# EAGLE board DL0WH_BiTuner_Ctrl_1V2 (EAGLE 7.7.0)
DL0WH Antenna BiTuner
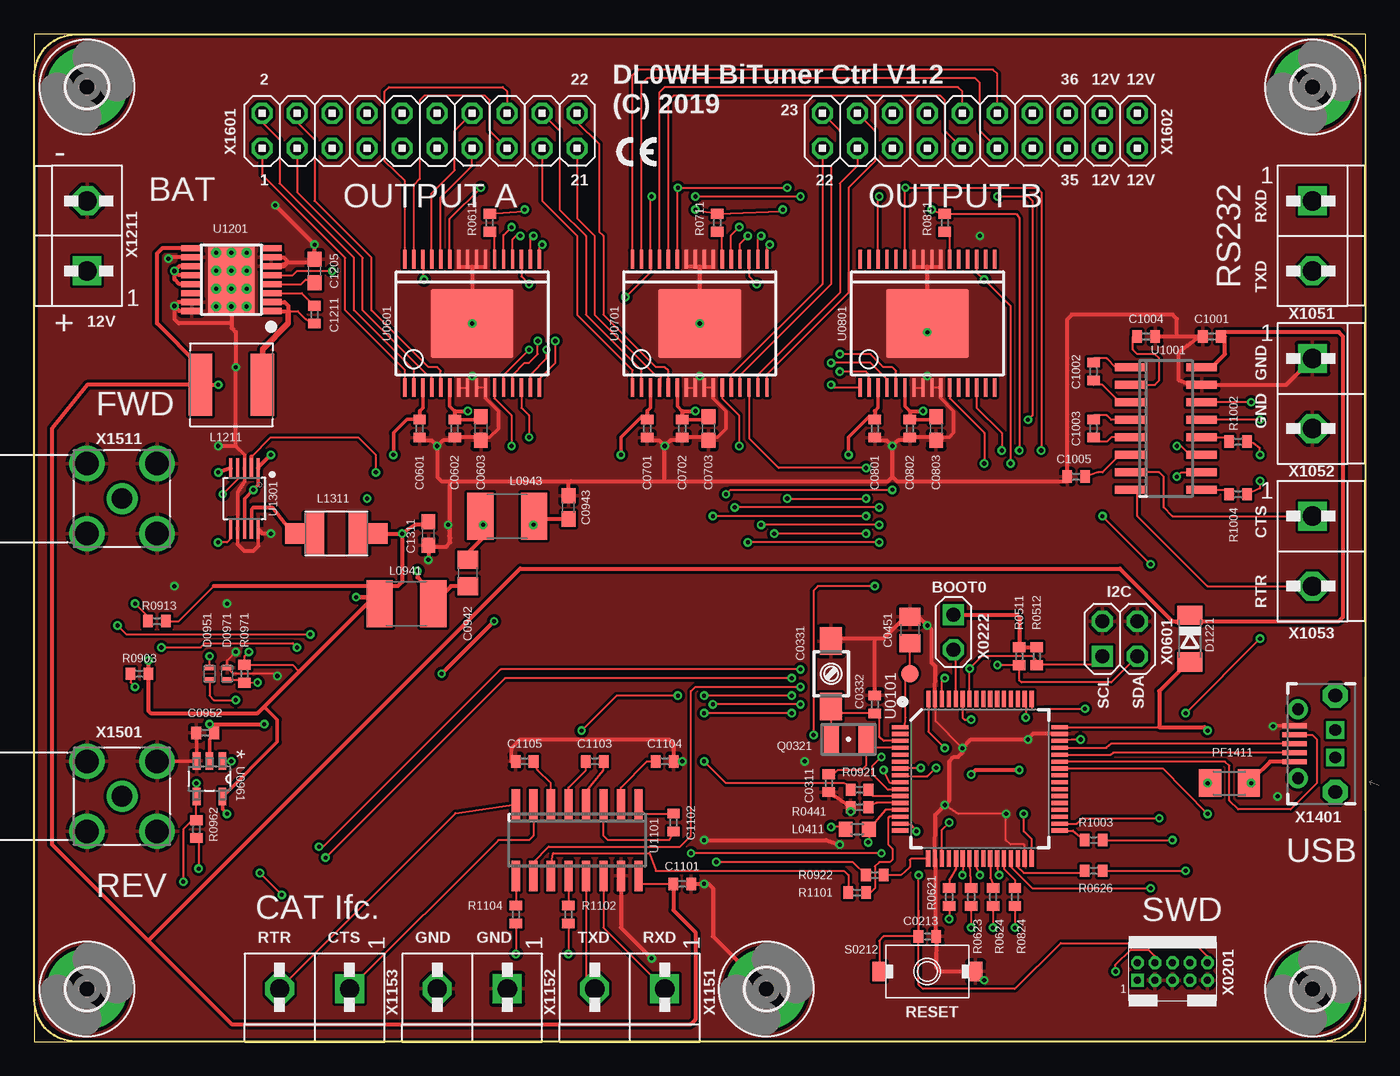
[diagram p17: board, top side]
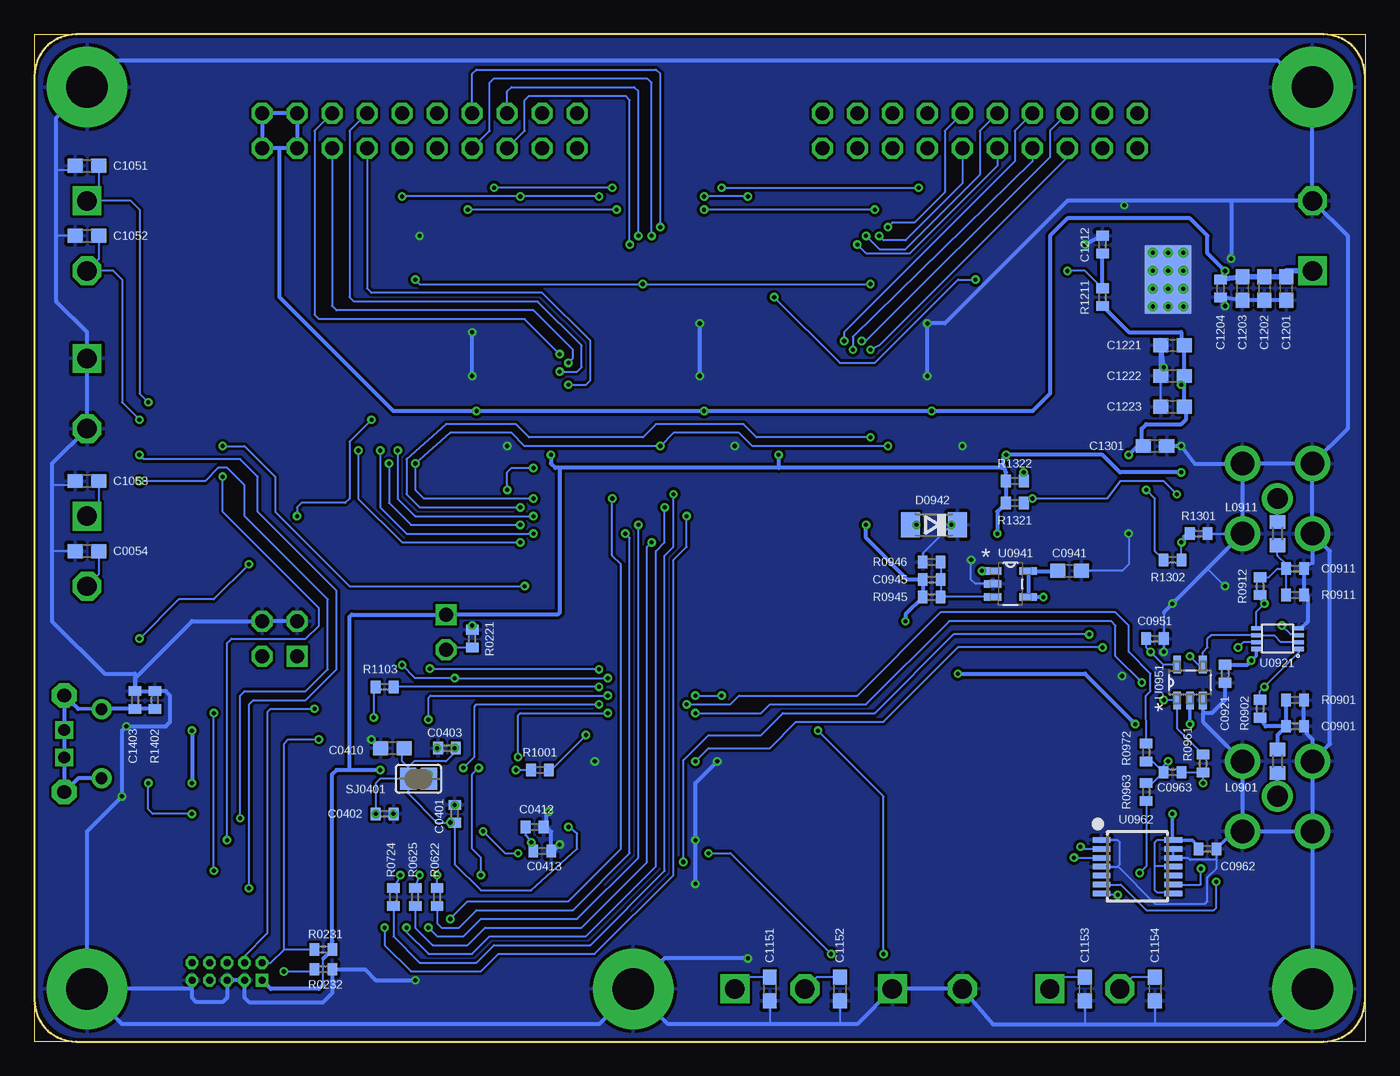
[diagram p18: board, bottom side, seen from below]

Size 96.52 x 73.03 mm. Coordinates in mm from the lower left corner, seen from the top.
Outline: 0,0 96.52,0 96.52,73.03 0,73.03 0,0
Copper layers (1*16): Top 0.035mm / dielectric 1.5mm / Bottom 0.035mm
Design rules "DL0WH_BiTuner_MCU_1V2": minimum track width 6mil, minimum drill 0.3mm, track to track 8mil, track to pad 8mil, pad to pad 6mil, via to via 8mil, smd to smd 0mil, copper to edge 10mil, drill to drill 10mil, minimum pad ring 8mil, minimum via ring 6mil, stop-mask expansion 2mil, vias tented up to drill 25mil, thermal gap 10mil
Net classes: 1 pwr_relay: width 1.5 mm, clearance 0.5 mm; 2 pwr_ttl: width 0.75 mm, clearance 0.5 mm; 3 usb_pair: width 0.254 mm, clearance 0.152 mm; 4 pwrA5: width 0.4 mm; 5 single50R: width 0.838 mm, clearance 0.152 mm; 6 mil6_nofill: width 0.152 mm, clearance 0.254 mm
Milling: 8 lines

## Footprints (pad centres in the part's own frame; a part is rotated, then mirrored left to right if it is on the bottom)
C0603 = smd 1.1 x 1: 1 -0.85,0; 2 0.85,0
C0402 = smd 0.7 x 0.9: 1 -0.65,0; 2 0.65,0
3MM2_X_2MM5 = smd 2 x 1.6: + -2.365,0; - 2.365,0
C0805 = smd 1.3 x 1.5: 1 -0.95,0; 2 0.95,0
SOD80C = smd 1.4 x 1.8: A 1.7,0; C -1.7,0
SOD923 = smd 0.4 x 0.6: A 0.45,0; C -0.45,0
3,0-PAD = drill 3 pad 5.842: B3,0 0,0
L0603 = smd 1 x 1.1: 1 -0.85,0; 2 0.85,0
L1812 = smd 1.9 x 3.4: 1 -1.95,0; 2 1.95,0
L_6.00MM_X_6.00MM = smd 1.7 x 4.5: 1 -2.25,0; 2 2.25,0
L_4.50MM_X_3.20MM = smd 1.5 x 3: 1 -1.6,0; 2 1.6,0 | smd 2 x 1.5: 3 -2.75,0; 4 2.75,0
M1206 = smd 1.6 x 2: 1 -1.4,0; 2 1.4,0
ABS07 = smd 1.1 x 1.9: 1 -1.25,0; 2 1.25,0
R0402 = smd 0.7 x 0.9: 1 -0.65,0; 2 0.65,0
KSR223G_SMD_1POL = smd 1 x 1.4: 1 -3.5,0; 2 3.5,0
SJ = smd 1.168 x 1.6: 1 -0.762,0; 2 0.762,0
B1,27 = smd 1.27 x 1.27: TP 0,0
LQFP64 = smd 1.2 x 0.3: 1 -5.775,3.75; 2 -5.775,3.25; 3 -5.775,2.75; 4 -5.775,2.25; 5 -5.775,1.75; 6 -5.775,1.25; 7 -5.775,0.75; 8 -5.775,0.25; 9 -5.775,-0.25; 10 -5.775,-0.75; 11 -5.775,-1.25; 12 -5.775,-1.75; 13 -5.775,-2.25; 14 -5.775,-2.75; 15 -5.775,-3.25; 16 -5.775,-3.75; 33 5.775,-3.75; 34 5.775,-3.25; 35 5.775,-2.75; 36 5.775,-2.25; 37 5.775,-1.75; 38 5.775,-1.25; 39 5.775,-0.75; 40 5.775,-0.25; 41 5.775,0.25; 42 5.775,0.75; 43 5.775,1.25; 44 5.775,1.75; 45 5.775,2.25; 46 5.775,2.75; 47 5.775,3.25; 48 5.775,3.75 | smd 0.3 x 1.2: 17 -3.75,-5.775; 18 -3.25,-5.775; 19 -2.75,-5.775; 20 -2.25,-5.775; 21 -1.725,-5.775; 22 -1.25,-5.775; 23 -0.75,-5.775; 24 -0.25,-5.775; 25 0.25,-5.775; 26 0.75,-5.775; 27 1.25,-5.775; 28 1.75,-5.775; 29 2.25,-5.775; 30 2.75,-5.775; 31 3.25,-5.775; 32 3.75,-5.775; 49 3.75,5.775; 50 3.25,5.775; 51 2.75,5.775; 52 2.25,5.775; 53 1.75,5.775; 54 1.25,5.775; 55 0.75,5.775; 56 0.25,5.775; 57 -0.25,5.775; 58 -0.75,5.775; 59 -1.25,5.775; 60 -1.75,5.775; 61 -2.25,5.775; 62 -2.75,5.775; 63 -3.25,5.775; 64 -3.725,5.775
SOICW32 = smd 0.25 x 1.3: 1 -4.875,-4.65; 2 -4.225,-4.65; 3 -3.575,-4.65; 4 -2.925,-4.65; 5 -2.275,-4.65; 6 -1.625,-4.65; 7 -0.975,-4.65; 8 -0.325,-4.65; 9 0.325,-4.65; 10 0.975,-4.65; 11 1.625,-4.65; 12 2.275,-4.65; 13 2.925,-4.65; 14 3.575,-4.65; 15 4.225,-4.65; 16 4.875,-4.65; 17 4.875,4.65; 18 4.225,4.65; 19 3.575,4.65; 20 2.925,4.65; 21 2.275,4.65; 22 1.625,4.65; 23 0.975,4.65; 24 0.325,4.65; 25 -0.325,4.65; 26 -0.975,4.65; 27 -1.625,4.65; 28 -2.275,4.65; 29 -2.925,4.65; 30 -3.575,4.65; 31 -4.225,4.65; 32 -4.875,4.65 | smd 6 x 5: 33 0,0
R-PDSO-G8 = smd 0.25 x 0.75: 1 -0.75,-1.55; 2 -0.25,-1.55; 3 0.25,-1.55; 4 0.75,-1.55; 5 0.75,1.55; 6 0.25,1.55; 7 -0.25,1.55; 8 -0.75,1.55
SOT95P280X145-5N = smd 1.27 x 0.559: 1 -1.295,0.94; 2 -1.295,0; 3 -1.295,-0.94; 4 1.295,-0.94; 5 1.295,0.94
SOT-23-5 = smd 1.27 x 0.559: 1 -1.295,0.94; 2 -1.295,0; 3 -1.295,-0.94; 4 1.295,-0.94; 5 1.295,0.94
TSSOP14 = smd 0.4 x 1.3: 1 -1.925,-2.6; 2 -1.275,-2.6; 3 -0.625,-2.6; 4 0.025,-2.6; 5 0.675,-2.6; 6 1.325,-2.6; 7 1.975,-2.6; 8 1.975,2.6; 9 1.325,2.6; 10 0.675,2.6; 11 0.025,2.6; 12 -0.625,2.6; 13 -1.275,2.6; 14 -1.925,2.6
SOIC16N = smd 0.6 x 2.2: 1 -4.445,-2.6; 2 -3.175,-2.6; 3 -1.905,-2.6; 4 -0.635,-2.6; 5 0.635,-2.6; 6 1.905,-2.6; 7 3.175,-2.6; 8 4.445,-2.6; 9 4.445,2.6; 10 3.175,2.6; 11 1.905,2.6; 12 0.635,2.6; 13 -0.635,2.6; 14 -1.905,2.6; 15 -3.175,2.6; 16 -4.445,2.6
HTSSOP16 = smd 0.45 x 1.5: 1 -2.275,-2.9; 2 -1.625,-2.9; 3 -0.975,-2.9; 4 -0.325,-2.9; 5 0.325,-2.9; 6 0.975,-2.9; 7 1.625,-2.9; 8 2.275,-2.9; 9 2.275,2.9; 10 1.625,2.9; 11 0.975,2.9; 12 0.325,2.9; 13 -0.325,2.9; 14 -0.975,2.9; 15 -1.625,2.9; 16 -2.275,2.9 | drill 0.305 pad 0.61: PAD 0.65,0; PAD3 -0.65,0; PAD4 -1.95,0; PAD5 1.95,0; PAD6 1.95,1.1; PAD7 1.95,-1.1; PAD8 0.65,1.1; PAD9 0.65,-1.1; PAD10 -0.65,1.1; PAD11 -0.65,-1.1; PAD12 -1.95,1.1; PAD13 -1.95,-1.1 | smd 5 x 3.4: PAD1 0,0 | smd 5 x 3.4 bottom: PAD2 0,0
S-PDSO-G10 = smd 0.3 x 1.45: 1 -1,-2.2; 2 -0.5,-2.2; 3 0,-2.2; 4 0.5,-2.2; 5 1,-2.2; 6 1,2.2; 7 0.5,2.2; 8 0,2.2; 9 -0.5,2.2; 10 -1,2.2
2X05_1MM27_SHROUDED_CORTEX_JTAG_SWD = drill 0.5 pad 0.914 square: 1 -2.54,-0.635 | drill 0.5 pad 0.914 octagon: 2 -2.54,0.635; 3 -1.27,-0.635; 4 -1.27,0.635; 5 0,-0.635; 6 0,0.635; 7 1.27,-0.635; 8 1.27,0.635; 9 2.54,-0.635; 10 2.54,0.635
1X02 = drill 1.016 square: 1 0,0 | drill 1.016 octagon: 2 0,2.54
2X02 = drill 1.016 square: 1 -1.27,-1.27 | drill 1.016 octagon: 2 -1.27,1.27; 3 1.27,-1.27; 4 1.27,1.27
WIRE-TO-BOARD_5MM08_1X02 = drill 1.4 square: 1 0,2.54 | drill 1.4 octagon: 2 0,-2.54
USB-B-MICRO-SMD_MOLEX-105017-0001 = smd 0.35 x 1.8: D+ 0,4.4; D- -0.65,4.4; GND 1.3,4.4; ID 0.65,4.4; VBUS -1.3,4.4 | drill 0.85 pad 1.45: JSHIELD -2.5,4.15; JSHIELD@2 2.5,4.15 | drill 1 pad 1.8 octagon: JSHIELD@3 -3.5,1.45; JSHIELD@6 3.5,1.45 | drill 0.85 square: JSHIELD@4 -1,1.45; JSHIELD@5 1,1.45
SMA_SMT_AMPHENOL_901-143 = drill 1.499: 1 0,0 | drill 1.702: 2 -2.54,2.54; 3 -2.54,-2.54; 4 2.54,-2.54; 5 2.54,2.54
2X10 = drill 1.016 octagon: 1 -11.43,-1.27; 2 -11.43,1.27; 3 -8.89,-1.27; 4 -8.89,1.27; 5 -6.35,-1.27; 6 -6.35,1.27; 7 -3.81,-1.27; 8 -3.81,1.27; 9 -1.27,-1.27; 10 -1.27,1.27; 11 1.27,-1.27; 12 1.27,1.27; 13 3.81,-1.27; 14 3.81,1.27; 15 6.35,-1.27; 16 6.35,1.27; 17 8.89,-1.27; 18 8.89,1.27; 19 11.43,-1.27; 20 11.43,1.27

## Placement (x,y rotation side)
C0054  10nF  [C0603]  92.71,35.56 180 bottom
C0213  100nF  [C0402]  64.77,7.62 0 top
C0311  22pF  [C0402]  57.63,18.73 270 top
C0331  JR200  [3MM2_X_2MM5]  57.78,26.67 270 top
C0332  18pF  [C0402]  60.96,24.45 90 top
C0401  100nF  [C0402]  66.04,16.51 90 bottom
C0402  100nF  [C0402]  71.12,16.51 0 bottom
C0403  100nF  [C0402]  66.6,21.27 180 bottom
C0410  4.7uF  [C0603]  70.56,21.27 180 bottom
C0412  10nF  [C0402]  60.25,15.56 0 bottom
C0413  1uF  [C0402]  59.69,13.81 0 bottom
C0451  47uF  [C0805]  63.5,29.84 90 top
C0601  100nF  [C0402]  27.94,44.45 90 top
C0602  100nF  [C0402]  30.48,44.45 270 top
C0603  22uF  [C0603]  32.38,44.45 270 top
C0701  100nF  [C0402]  44.45,44.45 90 top
C0702  100nF  [C0402]  46.99,44.45 270 top
C0703  22uF  [C0603]  48.9,44.45 270 top
C0801  100nF  [C0402]  60.96,44.45 90 top
C0802  100nF  [C0402]  63.5,44.45 270 top
C0803  22uF  [C0603]  65.41,44.45 270 top
C0901  N/A  [C0402]  5.08,22.86 0 bottom
C0911  N/A  [C0402]  5.08,34.29 0 bottom
C0921  100nF  [C0402]  10.16,26.67 270 bottom
C0941  22uF  [C0603]  21.43,34.13 0 bottom
C0942  2.2uF  [C0805]  31.43,33.97 90 top
C0943  22uF  [C0603]  38.73,38.73 90 top
C0945  1nF  [C0402]  31.43,33.5 180 bottom
C0951  100nF  [C0402]  15.24,29.21 0 bottom
C0952  100nF  [C0402]  12.38,22.38 180 top
C0962  100nF  [C0402]  11.43,13.97 0 bottom
C0963  100pF  [C0402]  13.97,19.53 180 bottom
C1001  1uF  [C0402]  85.41,51.12 180 top
C1002  1uF  [C0402]  76.83,48.58 270 top
C1003  1uF  [C0402]  76.83,44.45 270 top
C1004  1uF  [C0402]  80.64,51.12 0 top
C1005  1uF  [C0402]  75.56,40.96 180 top
C1051  10nF  [C0603]  92.71,63.5 180 bottom
C1052  10nF  [C0603]  92.71,58.42 180 bottom
C1053  10nF  [C0603]  92.71,40.64 180 bottom
C1101  1uF  [C0402]  46.99,11.43 0 top
C1102  1uF  [C0402]  46.35,15.88 270 top
C1103  1uF  [C0402]  40.64,20.32 180 top
C1104  1uF  [C0402]  45.72,20.32 0 top
C1105  1uF  [C0402]  35.56,20.32 180 top
C1151  10nF  [C0603]  43.18,3.81 270 bottom
C1152  10nF  [C0603]  38.1,3.81 270 bottom
C1153  10nF  [C0603]  20.32,3.81 270 bottom
C1154  10nF  [C0603]  15.24,3.81 270 bottom
C1201  10uF  [C0603]  5.71,54.61 270 bottom
C1202  10uF  [C0603]  7.3,54.61 270 bottom
C1203  10uF  [C0603]  8.89,54.61 270 bottom
C1204  10nF  [C0402]  10.48,54.61 270 bottom
C1205  3.3uF  [C0603]  20.32,55.88 270 top
C1211  0.47uF  [C0402]  20.32,52.7 90 top
C1212  100nF  [C0402]  19.05,57.78 90 bottom
C1221  22uF  [C0603]  13.97,50.48 180 bottom
C1222  22uF  [C0603]  13.97,48.26 180 bottom
C1223  22uF  [C0603]  13.97,46.04 180 bottom
C1301  22uF  [C0603]  15.24,43.18 0 bottom
C1311  22uF  [C0603]  28.57,36.83 270 top
C1403  1nF  [C0402]  89.22,24.77 270 bottom
D0942  CRS08  [SOD80C]  31.27,37.47 180 bottom
D0951  CMAD6001  [SOD923]  12.7,26.67 90 top
D0971  CMAD6001  [SOD923]  13.97,26.67 270 top
D1221  CRS08  [SOD80C]  83.82,29.21 270 top
H1711  MOUNT-PAD-ROUND3.0  [3,0-PAD]  3.81,3.81 0 top
H1721  MOUNT-PAD-ROUND3.0  [3,0-PAD]  53.09,3.81 0 top
H1731  MOUNT-PAD-ROUND3.0  [3,0-PAD]  92.71,3.81 0 top
H1751  MOUNT-PAD-ROUND3.0  [3,0-PAD]  3.81,69.22 0 top
H1761  MOUNT-PAD-ROUND3.0  [3,0-PAD]  92.71,69.22 0 top
L0411  10uH  [L0603]  59.69,15.4 0 top
L0901  2kR  [L0603]  6.35,20.32 270 bottom
L0911  2kR  [L0603]  6.35,36.83 90 bottom
L0941  20uH  [L1812]  26.99,31.75 180 top
L0943  20uH  [L1812]  34.29,38.1 180 top
L1211  2.2uH  [L_6.00MM_X_6.00MM]  14.29,47.62 0 top
L1311  10uH  [L_4.50MM_X_3.20MM]  21.91,36.83 180 top
PF1411  1.1A/2.2A  [M1206]  86.68,18.73 180 top
Q0321  ABS07-32.768KHZ  [ABS07]  59.05,21.91 180 top
R0221  33kR  [R0402]  64.77,29.21 270 bottom
R0231  220kR  [R0402]  75.56,6.67 0 bottom
R0232  220kR  [R0402]  75.56,5.24 180 bottom
R0441  0R  [R0402]  59.85,16.99 0 top
R0511  1kR  [R0402]  71.44,27.94 90 top
R0512  1kR  [R0402]  72.71,27.94 90 top
R0611  47R  [R0402]  33.02,59.37 270 top
R0621  47R  [R0402]  66.36,10.48 270 top
R0622  0R  [R0402]  67.31,10.48 270 bottom
R0623  47R  [R0402]  67.94,10.48 270 top
R0624  47R  [R0402]  69.53,10.48 270 top
R0625  47R  [R0402]  68.9,10.48 270 bottom
R0626  47R  [R0402]  76.83,12.38 0 top
R0711  47R  [R0402]  49.53,59.37 270 top
R0724  47R  [R0402]  70.48,10.48 270 bottom
R0811  47R  [R0402]  66.04,59.37 270 top
R0824  47R  [R0402]  71.12,10.48 270 top
R0901  1kR  [R0402]  5.08,24.77 180 bottom
R0902  15kR  [R0402]  7.62,24.13 90 bottom
R0903  150kR  [R0402]  7.62,26.67 0 top
R0911  1kR  [R0402]  5.08,32.38 180 bottom
R0912  15kR  [R0402]  7.62,33.02 270 bottom
R0913  150kR  [R0402]  8.89,30.48 0 top
R0921  47R  [R0402]  59.85,18.26 180 top
R0922  47R  [R0402]  60.96,12.06 180 top
R0945  8.2kR  [R0402]  31.43,32.23 180 bottom
R0946  33kR  [R0402]  31.43,34.77 0 bottom
R0961  1kR  [R0402]  11.75,20.16 270 bottom
R0962  1kR  [R0402]  11.75,15.4 270 top
R0963  20kR  [R0402]  15.88,18.1 90 bottom
R0971  10kR  [R0402]  15.24,26.67 270 top
R0972  47R  [R0402]  15.88,20.95 90 bottom
R1001  47R  [R0402]  59.85,19.68 0 bottom
R1002  47R  [R0402]  87.31,43.5 180 top
R1003  47R  [R0402]  76.83,14.61 0 top
R1004  47R  [R0402]  87.31,39.69 180 top
R1101  47R  [R0402]  59.69,10.79 180 top
R1102  47R  [R0402]  38.73,9.21 90 top
R1103  47R  [R0402]  71.12,25.72 0 bottom
R1104  47R  [R0402]  34.92,9.21 90 top
R1211  3R  [R0402]  19.05,53.98 270 bottom
R1301  100kR  [R0402]  12.06,36.83 180 bottom
R1302  220kR  [R0402]  13.97,34.92 180 bottom
R1321  1MR  [R0402]  25.4,39.05 180 bottom
R1322  1MR  [R0402]  25.4,40.64 180 bottom
R1402  330kR  [R0402]  87.79,24.77 270 bottom
S0212  KSR223GLFG  [KSR223G_SMD_1POL]  64.77,5.08 180 top
SJ0401  [SJ]  68.66,19.05 180 bottom
TP_VBAT  PTR1B1,27  [B1,27]  63.5,26.67 0 top
U0101  STM32L476RXT_64PIN_LDO  [LQFP64]  68.58,19.05 0 top
U0601  MC33996  [SOICW32]  31.75,52.07 0 top
U0701  MC33996  [SOICW32]  48.26,52.07 0 top
U0801  MC33996  [SOICW32]  64.77,52.07 0 top
U0921  TS5A23166  [R-PDSO-G8]  6.35,29.21 90 bottom
U0941  LM2611  [SOT95P280X145-5N]  25.72,33.18 0 bottom
U0951  OPA354  [SOT-23-5]  12.7,26.04 90 bottom
U0961  OPA354  [SOT-23-5]  12.7,19.05 270 top
U0962  MCP4661-103E-MS  [TSSOP14]  16.51,12.7 270 bottom
U1001  MAX232_SOIC16  [SOIC16N]  82.07,44.45 270 top
U1101  MAX232_SOIC16  [SOIC16N]  39.37,14.61 180 top
U1201  LM53603-Q1  [HTSSOP16]  14.29,55.24 90 top
U1301  TPS62056  [S-PDSO-G10]  15.24,39.37 180 top
X0201  FTSH-105-01-F-D-K  [2X05_1MM27_SHROUDED_CORTEX_JTAG_SWD]  82.55,5.08 0 top
X0222  [1X02]  66.67,30.96 180 top
X0601  [2X02]  78.74,29.21 0 top
X1051  WIRE-TO-BOARD_5MM08_1X02  [WIRE-TO-BOARD_5MM08_1X02]  92.71,58.42 0 top
X1052  WIRE-TO-BOARD_5MM08_1X02  [WIRE-TO-BOARD_5MM08_1X02]  92.71,46.99 0 top
X1053  WIRE-TO-BOARD_5MM08_1X02  [WIRE-TO-BOARD_5MM08_1X02]  92.71,35.56 0 top
X1151  WIRE-TO-BOARD_5MM08_1X02  [WIRE-TO-BOARD_5MM08_1X02]  43.18,3.81 270 top
X1152  WIRE-TO-BOARD_5MM08_1X02  [WIRE-TO-BOARD_5MM08_1X02]  31.75,3.81 270 top
X1153  WIRE-TO-BOARD_5MM08_1X02  [WIRE-TO-BOARD_5MM08_1X02]  20.32,3.81 270 top
X1211  WIRE-TO-BOARD_5MM08_1X02  [WIRE-TO-BOARD_5MM08_1X02]  3.81,58.42 180 top
X1401  MOLEX 105017-0001  [USB-B-MICRO-SMD_MOLEX-105017-0001]  95.81,21.59 90 top
X1501  SMA_SMT_AMPHENOL-901-143  [SMA_SMT_AMPHENOL_901-143]  6.35,17.78 90 top
X1511  SAMTEC SMA-J-P-H-RA-TH1  [SMA_SMT_AMPHENOL_901-143]  6.35,39.37 90 top
X1601  [2X10]  27.94,66.04 0 top
X1602  [2X10]  68.58,66.04 0 top

## Tracks (layer width: path | path; a pad name or v marks a point on that pad's centre or on a via)
+3V3  (via drill 0.3)
  Top 0.152: R0913.2 10.48,30.48 13.02,33.02 | 19.21,26.83 18.72,27.32 R0971.1 15.24,27.94 v15.56,28.26 | 8.27,27.61 v8.26,27.62
  Top 0.254: U0601.3 28.18,45.95 27.94,45.72 | U0701.3 44.69,45.95 44.45,45.72 | U0801.3 61.2,45.95 60.96,45.72 | C0601.2 27.78,45.09 27.73,45.14 27.04,45.14 26.04,44.13 v26.04,42.55 | C0701.2 44.03,45.3 42.55,43.81 v42.55,42.55 | C0801.2 60.54,45.3 59.05,43.81 v59.05,42.55 | v13.97,16.51 13.64,16.84 U0961.5 17.62,21.74 17.62,23.34 16.67,24.29
  Top 0.305: C1311.1 28.26,37.47 27.62,37.47 v26.67,36.83 | L1311.1 L1311.3 v26.67,36.83 | U1301.5 13.29,41.23 v13.34,41.27 | 27.94,45.72 C0601.2 | 44.45,45.72 C0701.2 | 60.96,45.72 C0801.2 | X0222.1 71.28,30.96 71.44,30.8 R0511.2 R0512.2 | v71.44,19.68 68.26,19.68 v67.94,19.37 | v26.67,36.83 26.67,33.34 26.35,33.02 25.4,33.02 | 25.4,33.02 13.02,33.02 | 24.61,32.23 19.21,26.83 16.67,24.29 16.19,23.81 8.41,23.81 8.26,23.97 8.26,26.67 R0903.2 8.27,27.61 | L0941.2 24.56,32.23 v23.34,32.23 24.61,32.23 | 25.4,33.02 24.61,32.23
  Bottom 0.152: 75.56,4.13 75.56,6.02 | v67.94,19.37 67.94,19.1 SJ0401.1 | C0951.1 15.89,28.59 v15.56,28.26 14.63,27.33 U0951.5 | 22.28,34.12 C0941.1 | U0962.14 13.89,14.61 | 12.08,14.14 C0962.1 | U0962.8 13.98,10.79 15.08,10.79 15.24,10.95 15.24,12.7 | 15.24,12.7 15.24,14.45 15.06,14.62 U0962.14 | U0962.11 13.94,12.7 15.24,12.7 | U0962.14 13.97,14.69
  Bottom 0.254: U0921.8 7.9,27.98 v8.26,27.62 | 13.89,14.61 12.54,14.61 12.08,14.14 | 13.97,14.69 v13.97,16.51
  Bottom 0.305: v26.67,36.83 26.67,38.42 R1321.2 R1322.2 26.04,41.27 26.25,41.91 | v13.34,41.27 17.78,41.27 19.05,42.55 v26.04,42.55 26.25,42.33 26.25,41.91 | v59.05,42.55 59.05,41.91 58.74,41.59 58.42,41.59 | 26.25,41.91 26.35,41.81 26.35,41.59 42.55,41.59 | 75.56,4.13 75.88,3.81 79.38,3.81 X0201.1 | 75.56,6.02 R0231.2 74.92,7.29 74.93,9.21 74.93,19.37 74.61,19.68 73.66,19.68 | v71.44,19.68 73.66,19.68 | 58.42,41.59 58.42,31.11 58.58,30.96 X0222.1 73.5,30.96 73.66,30.8 73.66,19.68 | C0921.1 8.56,27.32 v8.26,27.62 | 42.55,41.59 58.42,41.59 | v42.55,42.55 42.55,41.59 | 22.28,34.12 U0941.5 U0941.4 v23.35,32.24 v23.34,32.23
+5V  (via drill 0.3)
  Top 0.152: U1101.16 43.88,11.43 C1101.1 | 11.75,47.62 L1211.1
  Top 0.254: U1301.1 16.24,40.37 v15.88,40.01 15.24,39.37 U1301.8
  Top 0.305: U1201.9 9.26,57.52 8.89,57.15 8.89,52.07 12.04,48.92 L1211.1 v13.34,47.62 | U1301.1 16.24,41.64 v17.14,42.55 | 11.75,47.62 3.81,47.62 1.27,44.45 1.27,14.29 8.26,7.3 | 8.26,7.3 14.29,1.27 47.62,1.27 47.94,1.59 47.94,7.94 46.35,9.53 46.35,11.12 C1101.1 | 8.26,7.3 35.24,34.29 78.74,34.29 82.55,30.48 | U1001.16 85.41,48.9 86.36,49.85 86.36,51.12 C1001.1 86.38,51.44 94.61,51.44 94.93,51.12 94.93,30.8 94.61,30.48 82.55,30.48 | 82.55,30.48 arc60 D1221.C
  Bottom 0.152: 14.82,35.14 15.24,35.56 15.24,39.37 v15.88,40.01
  Bottom 0.305: C1222.1 C1223.1 13,45.73 13.02,45.09 13.34,44.77 15.88,44.77 16.19,44.45 16.19,43.5 C1301.1 16.51,43.18 v17.14,42.55 | C1222.1 C1221.1 13.34,50.5 13.34,51.44 17.14,51.44 19.04,53.33 R1211.2 | C1222.1 13.32,47.64 v13.34,47.62 | R1302.2 14.82,35.14
+12V  (via drill 0.3)
  Top 0.254: U0601.6 30.12,46.08 30.48,45.72 | C0603.1 32.28,45.3 32.07,45.09 30.64,45.09 30.62,45.1 C0602.1 | U0701.6 46.63,46.08 46.99,45.72 | C0703.1 48.79,45.3 48.58,45.09 47.15,45.09 47.13,45.1 C0702.1 | U0801.6 63.15,46.08 63.5,45.72 | C0803.1 65.3,45.3 65.09,45.09 63.66,45.09 63.64,45.1 C0802.1
  Top 0.305: C0602.1 30.48,45.72 v31.43,45.72 | C0702.1 46.99,45.72 v47.94,45.72 | C0802.1 63.5,45.72 v64.45,45.72 | U1201.11 10.5,56.22 v10.16,55.88 | U1201.12 10.47,55.57 v10.16,55.88 | U1201.13 10.5,54.92 10.16,55.26 v10.16,55.88
  Bottom 0.305: 7.62,55.24 C1202.1 | C1204.1 v10.16,55.88 11.43,57.15 11.43,58.42 12.7,59.69 21.59,59.69 22.86,58.42 22.86,46.99 24.13,45.72 v31.43,45.72 v47.94,45.72 v64.45,45.72 70.48,45.72 78.74,53.98 78.74,64.77 | 78.74,64.77 X1602.17 X1602.18 X1602.20 X1602.19 78.74,64.77
  Bottom 0.406: C1204.1 C1203.1 C1202.1 C1201.1 5.73,55.88 X1211.1
-1V5  (via drill 0.3)
  Top 0.152: 36.45,37.88 L0943.1
  Top 0.254: U0961.2 12.7,21.91 13.03,22.24 C0952.1 12.7,22.72 v12.7,23.02
  Top 0.305: C0943.1 36.45,37.88 | v36.2,37.47 36.2,38.05 L0943.1 | v12.7,23.02 v16.67,23.02 | v33.34,30.48 v29.53,26.67
  Bottom 0.254: v12.7,23.02 U0951.2
  Bottom 0.305: C0945.2 R0945.2 33.34,30.97 v33.34,30.48 | C0945.2 32.07,33.5 | C0945.2 33.18,33.5 36.2,36.51 v36.2,37.47 | v29.53,26.67 20.32,26.67 v16.67,23.02
CAT_DTE_CTS
  Top 0.152: X1153.1 33.66,14.61 35.88,14.61 36.2,14.92 U1101.7
  Bottom 0.152: C1153.1 22.01,4.66 X1153.1
CAT_DTE_RTR
  Top 0.152: X1153.2 30.54,16.57 U1101.8
  Bottom 0.152: C1154.1 16.93,4.66 X1153.2
CAT_DTE_RXD
  Top 0.152: U1101.14 41.27,8.26 X1151.1
  Bottom 0.152: C1151.1 44.87,4.66 X1151.1
CAT_DTE_TXD
  Top 0.152: U1101.13 40.01,4.45 X1151.2
  Bottom 0.152: C1152.1 39.79,4.66 X1151.2
CAT_MX_C1N
  Top 0.152: C1102.2 46.04,14.61 41.59,14.61 41.27,14.92 U1101.3
CAT_MX_C1P
  Top 0.152: U1101.1 44.2,16.51 C1102.1
CAT_MX_C2M
  Top 0.152: U1101.5 38.73,18.41 40.01,19.69 C1103.2
CAT_MX_C2P
  Top 0.152: U1101.4 40.01,18.1 41.27,19.68 C1103.1
CAT_MX_VM
  Top 0.152: U1101.6 37.47,18.73 36.51,19.69 C1105.1
CAT_MX_VP
  Top 0.152: U1101.2 42.55,18.41 44.45,20.32 C1104.1
GND  (via drill 0.3)
  Top 0.152: U0601.7 U0601.8 31.43,47.94 v31.75,48.26 32.08,47.94 U0601.9 U0601.10 | U0701.7 U0701.8 47.94,47.94 v48.26,48.26 48.59,47.94 U0701.9 U0701.10 | U0801.7 U0801.8 64.44,47.94 v64.77,48.26 65.09,47.94 U0801.9 U0801.10 65.75,46.7 65.72,46.67 | 32.7,56.2 32.7,56.7 U0601.23 | 30.8,56.2 30.8,56.7 U0601.26 | U0601.25 31.43,56.2 | U0601.24 32.08,56.2 32.07,56.2 | U0801.26 63.8,56.22 63.82,56.2 | U0801.25 64.44,56.2 64.45,56.2 | U0801.24 65.09,56.2 | U0801.23 65.75,56.22 65.72,56.2 | S0212.1 | 57.78,17.94 57.61,18.1 C0311.2 | U0101.31 71.84,14.21 71.75,14.29 70.8,14.29 70.48,14.61 v70.48,16.51 66.99,16.51 v66.04,17.14 | U0101.63 65.34,23.25 v67.31,21.27 | R0441.1 59.05,16.67 | 53.02,3.87 H1721.B3,0 53.02,3.81 | 84.45,51.12 C1001.2 | 64.14,30.8 C0451.2 63.18,30.8 | 57.96,29.21 C0331.+ | C0803.2 65.83,43.6 66.04,43.81 | v14.61,28.26 13.97,27.62 D0971.C 14.42,26.67 17.46,26.67 v17.62,26.51 | v30,37.47 30,36.67 30.16,36.51 | U0961.3 11.73,20.32 | C0952.2 11.76,22.36
  Top 0.254: 14.61,43.18 15.24,42.55 U1301.3 15.24,40.64 14.74,39.82 U1301.7 14.74,36.06 | U1301.10 16.24,35.92 | U0701.10 49.23,46.65 50.16,45.72 50.16,44.45 49.53,43.81 49.11,43.81 C0703.2 | 32.49,43.6 C0603.2 32.6,43.81 33.02,43.81 33.66,44.45 33.66,45.72 32.73,46.65 U0601.10 | U0701.26 47.28,56.22 47.31,56.2 | U0701.23 49.23,56.22 49.21,56.2 | U0701.25 47.94,56.2 | U0701.24 48.59,56.2 48.58,56.2 | X1401.GND 89.88,22.89 v89.85,22.86 | 65.72,43.81 66.04,43.81 66.36,43.81 66.67,44.13 66.67,45.72 65.72,46.67 | 11.73,20.32 X1501.4 | 11.76,22.36 U0961.3
  Top 0.305: U1201.10 9.88,56.87 v9.72,56.77 | U1201.6 17.78,56.22 | 17.78,56.22 18.12,56.22 18.41,56.52 | 18.41,56.52 20.3,56.52 C1205.1 v20.32,57.78 v17.46,60.64 | U1201.7 18.06,56.87 18.41,56.52 | 18.41,56.52 17.78,56.22 | U1201.15 10.44,53.62 v10.16,53.34 | U1201.16 10.53,52.97 v10.16,53.34 | v13.34,43.18 14.61,43.18 v14.61,48.9 14.61,51.44 14.29,51.75 14.29,52.07 | 16.24,35.92 15.88,35.56 15.24,35.56 14.74,36.06 | v17.14,36.83 16.51,36.83 16.51,36.9 U1301.10 | C0601.1 28.1,43.66 28.16,43.6 28.79,43.6 v29.21,43.18 | C0603.2 32.23,43.81 30.96,43.81 30.94,43.8 C0602.2 30.32,43.66 30.27,43.6 29.63,43.6 v29.21,43.18 | v28.57,34.92 C1311.2 28.89,35.88 29.84,35.88 30.16,36.2 30.16,36.51 30.16,40.64 | C0701.1 44.45,43.66 44.51,43.6 45.3,43.6 v45.72,43.18 | v45.72,43.18 46.14,43.6 46.77,43.6 46.83,43.66 C0702.2 47.13,43.8 47.15,43.81 48.58,43.81 48.79,43.6 C0703.2 | C0803.2 65.3,43.6 65.09,43.81 63.66,43.81 63.64,43.8 C0802.2 63.34,43.66 63.28,43.6 62.65,43.6 v62.23,43.18 | C0801.1 61.12,43.66 61.17,43.6 61.81,43.6 v62.23,43.18 | U1201.PAD4 14.29,52.07 | 14.29,52.07 10.48,52.07 10.16,52.39 v10.16,53.34 | v29.21,43.18 29.21,40.96 29.53,40.64 30.16,40.64 | 30.16,40.64 38.89,40.64 | 38.89,40.64 45.72,40.64 | 45.72,40.64 61.91,40.64 62.23,40.96 | 62.23,40.96 v62.23,43.18 | 45.72,40.64 v45.72,43.18 | 30.8,56.2 31.43,56.2 31.75,56.2 | 31.75,56.2 32.07,56.2 32.7,56.2 | 31.75,56.2 U0601.33 | U0701.33 48.26,56.2 | 48.26,56.2 47.94,56.2 47.31,56.2 | 48.26,56.2 48.58,56.2 49.21,56.2 | 63.82,56.2 64.45,56.2 64.77,56.2 | 64.77,56.2 65.09,56.2 65.72,56.2 | v64.77,51.44 U0801.33 64.77,56.2 | S0212.1 65.72,5.08 65.41,5.4 C0213.2 65.34,7.86 65.34,13.27 U0101.18 65.34,16.44 v66.04,17.14 66.36,17.46 66.36,20.32 66.67,20.64 66.99,20.64 67.31,20.95 v67.31,21.27 67.94,21.91 v72.07,21.91 72.42,22.3 U0101.47
  Top 0.305: S0212.1 v68.9,4.45 | R0441.1 58.09,17.77 57.78,17.94 | 59.05,16.67 v59.21,16.67 | 53.02,3.87 49.21,7.62 49.21,11.11 48.9,11.43 v48.58,11.43 C1101.2 | U1101.15 42.55,8.26 v44.77,6.03 | C1105.2 34.61,20.32 34.61,21.27 35.24,21.91 46.04,21.91 46.35,21.59 46.35,21.27 C1104.2 v46.99,20.32 | X1052.1 90.81,47.62 U1001.15 83.82,47.62 83.03,47.94 83.03,50.01 83.66,50.48 84.45,51.12 | 62.23,40.96 62.55,40.64 74.93,40.64 74.93,40.95 C1005.2 74.93,52.39 75.25,52.7 82.55,52.7 82.87,52.39 82.87,51.12 | C1001.2 82.87,51.12 | 82.87,51.12 C1004.2 | 64.14,30.8 v64.77,30.16 65.09,29.84 65.09,27.46 65.34,27.21 U0101.63 | 63.18,30.8 61.59,29.21 60.96,29.21 | 60.96,29.21 57.96,29.21 | C0332.2 60.96,29.21 | v48.58,14.61 57.44,14.61 v58.42,14.27 | C0943.2 38.73,40.48 38.89,40.64
  Bottom 0.152: R1301.1 X1511.3 | C1223.2 C1222.2 | 59.52,15.48 C0412.2 | C0410.2 71.44,21.27 v72.07,21.91 | C0402.2 70.47,16.21 v70.48,16.51 | C0401.2 66.34,17.16 v66.04,17.14 | C0403.2 67.25,21.53 v67.31,21.27 | 59.28,16.6 v59.21,16.67 | R0221.1 v64.77,30.16 | 14.59,31.11 C0951.2 14.59,28.27 v14.61,28.26 | C1152.2 38.1,1.27 | C1151.2 43.18,1.27 | C1154.2 15.24,1.27 | C1153.2 20.32,1.27 | C1051.2 93.88,63.18 94.93,63.18 | C1052.2 94.93,58.42 | C1053.2 93.88,40.32 95.25,40.32 | C0054.2 95.25,35.56 | v17.14,36.83 17.14,34.61 17.62,34.13 C0941.2 | D0942.C v30,37.47 32.07,35.4 32.07,34.78 R0946.1 | U0941.2 28.26,33.18 28.57,33.5 v28.57,34.92 | v10.16,33.02 11.43,34.29 | C0962.2 10.79,13.96 10.79,13.18 | 10.79,13.18 12.7,13.18 12.85,13.32 U0962.12 U0962.13 13.96,13.97 13.97,13.97 | U0962.4 17.96,12.68 17.94,12.7 | 17.94,12.7 17.78,12.86 17.78,14.45 17.94,14.61 19.09,14.61 U0962.1 | 17.94,12.7 15.24,10 11.59,10 11.43,10.16 11.43,11.91 10.79,12.54 10.79,13.18
  Bottom 0.254: U0921.4 4.65,29.96 | C0962.2 9.51,15.24 X1501.3
  Bottom 0.305: C1212.2 20.3,57.8 v20.32,57.78 | v10.16,53.34 C1204.2 C1203.2 C1202.2 C1201.2 | C1301.2 v13.34,43.18 12.38,41.91 X1511.4 | X1211.2 9.72,60.96 | 9.72,60.96 v9.72,56.77 | X1211.2 H1751.B3,0 6.35,71.12 90.81,71.12 H1761.B3,0 94.93,66.99 94.93,63.18 94.93,58.42 94.93,53.66 92.71,51.44 X1052.1 X1052.2 95.25,41.91 95.25,40.32 95.25,35.56 95.25,30.48 91.44,26.67 89.22,26.67 C1403.1 89.2,25.4 C1403.1 | X1501.2 H1711.B3,0 6.35,1.27 15.24,1.27 20.32,1.27 26.99,1.27 X1152.2 X1152.1 36.83,1.27 38.1,1.27 43.18,1.27 50.55,1.27 H1721.B3,0 | X1501.2 X1501.3 X1501.4 11.76,23.19 11.76,23.81 | X1501.5 X1501.2 | X1501.5 3.81,21.91 4.23,22.33 C0901.2 R0901.1 | U0951.3 11.76,23.81 | C0921.2 10.16,24.77 11.11,23.81 11.76,23.81 | X1511.2 3.81,34.71 C0911.2 R0911.1 4.13,32.28 4.13,30.48 4.65,29.96 | X1511.5 X1511.4 | X1511.2 X1511.5 | X1511.4 X1511.3 11.43,34.29 v13.97,31.75 14.45,31.27 14.59,31.11 | C1222.2 C1221.2 v14.62,48.91 v14.61,48.9 | X1211.2 1.27,58.42 1.27,44.45 X1511.5 | 9.72,60.96 17.46,60.96 | 17.46,60.96 21.59,60.96 30.48,52.07 U0601.33 v31.75,48.26 | v17.46,60.64 17.46,60.96 | v48.26,48.26 U0701.33 | v64.77,48.26 v64.77,51.44 | H1731.B3,0 92.71,15.24 v90.17,17.78 90.17,22.54 v89.85,22.86 87,22.86 86.68,23.18 86.68,25.08 87,25.4 87.77,25.4 R1402.1 C1403.1 | v68.9,4.45 71.75,4.45 72.55,5.24 R0232.1 74.92,3.51 75.56,2.86 80.96,2.86 81.28,3.17 X0201.3 X0201.5 82.55,3.17 82.87,2.86 84.77,2.86 85.09,3.17 85.09,3.81 | 59.52,15.48 59.21,15.4 59.04,15.22 C0413.2 58.9,13.81 v58.42,14.27 | X0601.2 X0601.4 85.09,30.48 89.22,26.35 C1403.1 | C0412.2 59.37,15.56 59.37,16.51 59.28,16.6
  Bottom 0.305: v44.77,6.03 50.8,6.03 55.56,1.27 90.17,1.27 H1731.B3,0 | v48.58,11.43 v48.58,14.61 48.58,18.73 v46.99,20.32 | X1501.5 2.54,21.59 2.54,35.56 X1511.2 | 85.09,3.81 X0201.9 | 85.09,3.81 H1731.B3,0
  other vias: 31.75,52.07 48.26,52.07 55.88,20.32 68.58,58.42
  pour Top: 0.32,3.32 0.32,69.71 arc-88 3,72.71 93.2,72.71 arc-98 96.2,69.71 96.2,3.32 arc-88 93.2,0.32 3,0.32 arc-78
  pour Bottom: 0.32,3.32 0.32,69.71 arc-88 3,72.71 93.2,72.71 arc-98 96.2,69.71 96.2,3.32 arc-88 93.2,0.32 3,0.32 arc-78
LM2611_NFB
  Bottom 0.152: R0946.2 C0945.1 R0945.1 U0941.3
LM2611_SW  (via drill 0.3)
  Top 0.305: C0942.1 30.21,33.02 29.23,32.05 | 29.23,32.05 L0941.1 | v27.78,34.13 27.78,33.66 28.1,33.34 28.1,33.18 29.23,32.05
  Bottom 0.305: U0941.1 27.77,34.12 v27.78,34.13
LM53603_BIAS  (via drill 0.3)
  Top 0.152: U1201.5 18.74,55.57 19.05,55.88 v21.59,55.88
  Bottom 0.152: R1211.1 19.7,55.26 20.32,55.88 v21.59,55.88
  Bottom 0.305: R1211.1 C1212.1
LM53603_CBOOT
  Top 0.152: U1201.3 19.39,54.27 20,53.66 20.3,53.34
  Top 0.305: 20.3,53.34 C1211.2
LM53603_SW
  Top 0.152: 18.41,52.97 19.1,52.97 19.68,52.39 20.3,52.07
  Top 0.305: U1201.1 18.41,52.97 18.41,53.34 18.14,53.62 U1201.2 | 20.3,52.07 C1211.1
  Top 0.406: L1211.2 16.54,50.19 18.41,52.07 18.41,52.97
LM53603_VCC
  Top 0.152: U1201.4 19.36,54.92 19.68,55.24 20.3,55.24
  Top 0.305: 20.3,55.24 C1205.2
LM_DA  (via drill 0.3)
  Top 0.305: C0942.2 31.43,35.4 32.54,36.51 v32.54,37.47 L0943.2
  Bottom 0.305: v32.54,37.47 32.54,37.9 D0942.A
MCU_NRST  (via drill 0.3)
  Top 0.152: C0213.1 61.59,7.62 61.28,7.3 S0212.2 | C0213.1 64.14,9.51 64.14,4.13 64.45,3.81 71.12,3.81 74.45,7.14 84.14,7.14 85.09,6.19 X0201.10 | U0101.7 63.28,19.75 63.18,19.84 v64.29,19.84 | C0213.1 64.12,10.46 v64.14,12.06
  Bottom 0.152: v64.14,12.06 64.14,13.34 64.77,13.97 64.77,19.37 v64.29,19.84
MCU_VBAT
  Top 0.152: U0101.1 63.13,22.75 63.18,23.5 63.18,26.99 TP_VBAT.TP C0451.1
MCU_VDD  (via drill 0.3)
  Top 0.152: U0101.32 72.34,14.66 71.75,15.24 v71.75,16.51 | U0101.19 65.84,15.36 v66.36,15.88 | U0101.64 64.84,22.48 v66.04,21.27 | L0411.1 58.58,15.56 v57.78,15.56
  Bottom 0.152: C0402.1 71.77,16.21 v71.75,16.51 71.75,18.73 71.44,19.05 SJ0401.2 | C0403.1 65.95,21.5 v66.04,21.27 66.04,20.95 66.67,20.32 68.99,20.32 69.42,19.89 | SJ0401.2 69.42,19.89 | 69.42,19.89 69.85,20.32 69.85,21.21 C0410.1 | SJ0401.2 69.42,17.99 67.31,15.88 v66.36,15.88 66.34,15.86 C0401.1 66.04,12.86 64.14,10.95 60.48,10.95 57.15,13.97 57.15,15.08 v57.78,15.56
MCU_VDDA  (via drill 0.3)
  Top 0.152: U0101.13 61.73,16.8 L0411.2 60.54,14.55 v60.48,14.45
  Bottom 0.152: C0413.1 60.5,14.3 v60.48,14.45 60.9,14.99 C0412.1
MCU_VREF_M
  Top 0.152: U0101.12 61.08,17.3 R0441.2
MP_CAT_CTS_R  (via drill 0.3)
  Top 0.152: U1101.10 36.2,13.02 37.31,14.13 46.83,14.13 47.62,14.92 47.62,25.4 47.94,25.72 v55.56,25.72
  Bottom 0.152: v55.56,25.72 R1103.2
MP_CAT_RTR_R
  Top 0.152: U1101.9 R1104.2
MP_CAT_RXD_R
  Top 0.152: U1101.11 37.47,12.7 37.62,13.65 44.61,13.65 45.09,12.38 58.74,12.38 59.05,12.06 59.05,10.79 R1101.2
MP_CAT_TXD_R
  Top 0.152: U1101.12 R1102.2
MP_RS_CTS_R  (via drill 0.3)
  Top 0.152: R1003.2 v82.55,14.61 | v82.87,40.96 83.19,41.27 U1001.10
  Bottom 0.152: v82.55,14.61 82.55,28.89 82.23,29.21 76.83,29.21 75.88,30.16 75.88,31.43 82.87,38.42 v82.87,40.96
MP_RS_RTR_R
  Top 0.152: U1001.9 86.68,40.01 87,39.69 R1004.2
MP_RS_RXD_R  (via drill 0.3)
  Top 0.152: U1001.11 83.82,42.55 83.19,43.18 v82.87,43.18 | v60.96,33.02 56.83,33.02 56.52,32.7 v56.52,22.23
  Bottom 0.152: v82.87,43.18 81.28,43.18 79.06,40.96 79.06,38.42 73.66,33.02 v60.96,33.02 | v56.52,22.23 59.05,19.68 R1001.2
MP_RS_TXD_R
  Top 0.152: U1001.12 86.68,43.81 87,43.5 R1002.2
N$12
  Top 0.152: U0601.22 33.38,58.48 R0611.2
N$13
  Top 0.152: U0701.22 49.88,58.48 R0711.2
N$15
  Top 0.152: U0801.22 66.39,58.48 R0811.2
OPA_FB  (via drill 0.3)
  Top 0.152: v16.35,12.22 v17.94,10.64
  Bottom 0.152: R0963.1 15.88,12.7 v16.35,12.22 | v17.94,10.64 19.05,10.64 19.04,10.79 U0962.7
OPA_PULL  (via drill 0.3)
  Top 0.152: R0962.2 11.73,14.75 11.75,14.61 11.91,14.45 v11.91,12.54
  Bottom 0.152: U0962.9 11.96,11.38 11.91,11.43 v11.91,12.54
PA0
  Top 0.152: U0101.14 62,16.3 61.91,16.19 61.91,14.29 62.23,13.97 62.23,13.18 62.07,13.02 61.28,13.02 60.96,12.7 60.96,11.11 60.64,10.79 R1101.1
PA1  (via drill 0.3)
  Top 0.152: U0101.15 63.53,15.75 v63.98,15.24 | R1102.1 v38.73,6.35 | v61.44,13.65 v47.62,13.65
  Bottom 0.152: v63.98,15.24 62.39,13.65 v61.44,13.65 | v47.62,13.65 46.04,13.65 v38.73,6.35
PA3
  Top 0.152: U0101.17 64.83,13.59 64.77,13.26 63.59,13.26 63.5,13.18 63.5,12.64 62.87,12.06 R0922.1
PA5
  Top 0.152: U0101.21 66.84,12.54 66.36,11.75 R0621.1
PA6  (via drill 0.3)
  Top 0.152: U0101.22 67.34,12.73 v67.31,12.06
  Bottom 0.152: R0622.1 v67.31,12.06
PA7
  Top 0.152: U0101.23 67.84,12.81 R0623.1
PA9  (via drill 0.3)
  Top 0.152: U0101.42 81.85,19.8 v85.09,16.51 | v88.27,18.73 88.39,19.05
  Top 0.305: X1401.VBUS 89.64,20.29 88.39,19.05 PF1411.1
  Bottom 0.152: v85.09,16.51 87.95,16.51 88.27,16.83 v88.27,18.73
PA10
  Top 0.152: X1401.ID 92.69,22.24 93.03,21.91 93.03,18.73 91.12,16.83 87.31,16.83 86.68,17.46 86.68,20 86.36,20.3 U0101.43
PA11
  Top 0.152: X1401.D- 78.25,20.94 78.06,20.8 U0101.44
PA12
  Top 0.152: X1401.D+ 78.11,21.59 77.77,21.3 U0101.45
PA13  (via drill 0.3)
  Top 0.152: U0101.46 75.25,21.91 v75.88,21.91
  Bottom 0.152: 78.42,6.67 78.42,21.59 78.11,21.91 v75.88,21.91 | X0201.2 79.38,5.71 78.42,6.67 | R0231.1 78.42,6.67
PA14  (via drill 0.3)
  Top 0.152: U0101.49 72.36,24.1 73.34,24.13 v76.2,24.13 | v78.42,5.08 78.42,5.56 79.53,6.67 80.8,6.67 81.28,6.19 X0201.4
  Bottom 0.152: v78.42,5.08 76.37,5.08 R0232.2 | v76.2,24.13 79.38,24.13 79.63,23.88 79.63,7.84 81.28,6.19 X0201.4
PA15  (via drill 0.3)
  Top 0.152: U0101.50 71.91,24.02 v71.91,23.5
  Bottom 0.152: R1103.1 71.91,25.61 v71.91,23.5
PB0
  Top 0.152: U0101.26 69.34,11.87 69.53,11.43 R0624.1
PB1  (via drill 0.3)
  Top 0.152: U0101.27 69.84,12.53 v69.98,12.06
  Bottom 0.152: v69.98,12.06 R0724.1
PB2
  Top 0.152: U0101.28 70.34,12.53 71.12,11.75 R0824.1
PB6  (via drill 0.3)
  Top 0.152: X0601.1 76.83,27.3 72.72,27.3 R0512.1 72.71,27.62 72.39,27.94 68.74,27.94 v67.84,27.04 U0101.58 | v55.56,26.99 33.81,26.99 20.95,14.13 v20.64,14.13
  Bottom 0.152: v55.56,26.99 67.79,26.99 67.84,26.94 v67.84,27.04 | v20.64,14.13 20.48,13.97 U0962.2
PB7  (via drill 0.3)
  Top 0.152: U0101.59 67.33,23.5 67.47,23.34 v67.94,23.34 | v54.93,25.08 v48.58,25.08 | v46.67,25.08 42.23,25.08 v39.69,22.54 | R1104.1 v34.92,6.35
  Bottom 0.152: v67.94,23.34 67.94,24.92 67.79,25.08 v54.93,25.08 | v48.58,25.08 v46.67,25.08 | v34.92,6.35 34.92,17.78 v39.69,22.54
PB9  (via drill 0.3)
  Top 0.152: X0601.3 78.11,26.04 71.6,26.04 71.44,26.19 R0511.1 71.42,27.3 v69.85,27.3 | U0101.62 65.84,26.15 v66.04,26.35 | v54.93,26.35 34.13,26.35 v21.11,13.34
  Bottom 0.152: v69.85,27.3 68.9,26.35 v66.04,26.35 v54.93,26.35 | v21.11,13.34 19.12,13.34 U0962.3
PB10  (via drill 0.3)
  Top 0.152: U0101.29 70.84,12.66 72.39,11.11 v80.96,11.11 | v88.9,42.55 88.9,43.02 88.42,43.4 R1002.1
  Bottom 0.152: v80.96,11.11 80.96,24.45 80.64,24.77 76.83,24.77 74.61,26.99 74.61,32.7 80.33,38.42 80.33,40.96 81.6,42.23 88.58,42.23 v88.9,42.55
PB11
  Top 0.152: U0101.30 71.34,12.64 71.75,12.22 75.88,12.22 76.04,12.38 R0626.1 76.2,12.38
PB12
  Top 0.152: U0101.33 75.34,15.3 R1003.1
PB13  (via drill 0.3)
  Top 0.152: U0101.34 75.6,15.8 76.04,16.19 v81.6,16.19 | v88.9,40.64 88.9,40.11 R1004.1
  Bottom 0.152: v81.6,16.19 81.6,25.08 81.28,25.4 76.83,25.4 75.25,26.99 75.25,32.07 81.28,38.1 81.28,40.32 82.55,41.59 83.19,41.59 84.14,40.64 v88.9,40.64
PC0  (via drill 0.3)
  Top 0.152: U0101.8 63.62,19.25 64.77,19.25 v65.41,19.84 | v55.56,24.45 v49.21,24.45
  Bottom 0.152: v65.41,19.84 64.61,20.64 64.61,24.29 64.45,24.45 v55.56,24.45 | v49.21,24.45 46.04,24.45 45.4,25.08 36.83,25.08 30.8,31.11 18.1,31.11 17.14,30.16 17.14,28.26 15.56,26.67 15.56,25.4 15.89,25.07 R0972.2
PC1  (via drill 0.3)
  Top 0.152: U0101.9 62.83,18.73 62.07,18.73 v61.59,19.68
  Bottom 0.152: R1001.1 v61.59,19.68
PC2  (via drill 0.3)
  Top 0.152: D0971.A 15.04,26.22 R0971.2 v16.19,26.04 | U0101.10 63.35,18.25 62.71,18.26 61.91,18.26 60.8,19.37 60.8,20 v61.44,20.64 | v54.93,23.81 v48.58,23.81
  Bottom 0.152: v61.44,20.64 61.44,23.65 61.28,23.81 v54.93,23.81 | v48.58,23.81 43.81,23.81 43.18,24.45 36.2,24.45 30.16,30.48 18.41,30.48 18.1,30.16 18.1,27.94 v16.19,26.04
PC3
  Top 0.152: U0101.11 60.85,17.8 R0921.1
PC4  (via drill 0.3)
  Top 0.152: U0101.24 68.34,12.62 v68.58,12.06
  Bottom 0.152: R0625.1 v68.58,12.06
PC14_OSC32_IN
  Top 0.152: Q0321.2 57.8,23.81 | 57.8,23.81 C0331.- | 57.8,23.81 58.59,23.8 C0332.1 60.98,23.81 60.96,23.81 61.28,23.5 61.28,22.07 61.59,21.8 U0101.3
PC15_OSC32_OUT
  Top 0.152: U0101.4 60.8,21.3 60.49,21.57 Q0321.1 60.33,20 59.99,19.68 58.26,19.68 57.96,19.38 C0311.1
PH3_BOOT0
  Top 0.152: U0101.60 66.84,28.25 X0222.2
  Bottom 0.152: R0221.2 66.53,28.56 X0222.2
RELAY1
  Top 0.152: U0601.1 26.88,48.69 22.54,53.02 22.54,56.83 16.51,62.87 X1601.1
RELAY2
  Top 0.152: U0601.2 27.52,48.67 23.18,53.02 23.18,56.83 17.78,62.23 17.78,65.41 16.51,66.67 X1601.2
RELAY3
  Top 0.152: U0601.4 28.82,48.33 28.51,48.33 23.81,53.02 23.81,56.83 19.05,61.59 X1601.3
RELAY4
  Top 0.152: U0601.5 29.48,48.63 29.21,48.9 28.57,48.9 24.45,53.02 24.45,56.83 20.32,60.96 20.32,65.41 19.05,66.67 X1601.4
RELAY5  (via drill 0.3)
  Top 0.152: U0601.12 34.02,48.31 v35.88,50.16
  Bottom 0.152: X1601.5 21.59,64.14 35.24,50.48 v35.88,50.16
RELAY6  (via drill 0.3)
  Top 0.152: U0601.13 34.67,48.33 35.56,49.21 35.88,49.21 36.51,49.85 v36.51,50.8
  Bottom 0.152: X1601.6 22.86,66.04 22.86,64.14 36.2,50.8 v36.51,50.8
RELAY7  (via drill 0.3)
  Top 0.152: U0601.15 35.98,48.36 37.15,49.53 v37.15,50.16
  Bottom 0.152: X1601.7 24.13,63.82 37.15,51.12 v37.15,50.16
RELAY8  (via drill 0.3)
  Top 0.152: U0601.16 36.62,48.05 37.78,49.21 v37.78,50.8
  Bottom 0.152: X1601.8 25.4,66.04 25.4,63.82 37.78,51.44 v37.78,50.8
RELAY9  (via drill 0.3)
  Top 0.152: U0601.17 36.62,57.58 36.72,57.9 v36.83,57.78
  Bottom 0.152: X1601.9 26.67,63.5 33.02,57.15 36.2,57.15 v36.83,57.78
RELAY10  (via drill 0.3)
  Top 0.152: U0601.18 35.98,58.2 v36.2,58.42
  Bottom 0.152: X1601.10 27.94,66.04 27.94,62.87 33.34,57.47 35.24,57.47 v36.2,58.42
RELAY11  (via drill 0.3)
  Top 0.152: U0601.20 34.67,58.17 34.92,58.42 v35.24,58.42
  Bottom 0.152: X1601.11 29.21,62.23 33.34,58.1 34.92,58.1 v35.24,58.42
RELAY12  (via drill 0.3)
  Top 0.152: U0601.21 34.02,58.47 v34.61,59.05
  Bottom 0.152: X1601.12 30.48,66.04 30.48,61.59 32.7,59.37 34.29,59.37 v34.61,59.05
RELAY13
  Top 0.152: U0601.28 29.48,61.23 31.75,63.5 X1601.13
RELAY14
  Top 0.152: U0601.29 28.82,61.53 30.48,63.18 30.48,66.04 X1601.14
RELAY15
  Top 0.152: X1601.15 33.02,66.04 33.02,68.26 32.7,68.58 28.26,68.58 27.94,68.26 27.94,62.55 27.52,62.13 U0601.31
RELAY16
  Top 0.152: U0601.32 26.88,62.44 25.4,63.82 25.4,68.9 25.72,69.22 33.97,69.22 34.29,68.9 X1601.16
RELAY17
  Top 0.152: X1601.17 36.83,60.96 39.37,58.42 39.37,52.7 43.38,48.69 U0701.1
RELAY18
  Top 0.152: U0701.2 44.03,48.67 40.01,52.7 40.01,58.42 38.1,60.33 38.1,66.04 X1601.18
RELAY19
  Top 0.152: X1601.19 39.37,59.69 40.64,58.42 40.64,52.7 45.09,48.26 45.4,48.26 45.4,47.49 U0701.4
RELAY20
  Top 0.152: U0701.5 45.98,48.63 45.72,48.9 45.09,48.9 41.27,52.7 41.27,58.42 40.96,58.74 40.96,65.09 39.37,66.67 X1601.20
RELAY21
  Top 0.152: U0701.12 50.53,48.31 57.15,54.93 X1602.1
RELAY22
  Top 0.152: U0701.13 51.19,48.33 57.78,54.93 57.78,63.5 58.42,64.14 58.42,66.04 X1602.2
RELAY23
  Top 0.152: U0701.15 52.48,48.36 58.42,54.29 58.42,62.23 59.69,63.5 X1602.3
RELAY24
  Top 0.152: U0701.16 53.13,48.37 59.05,54.29 59.05,61.91 60.96,63.82 60.96,66.04 X1602.4
RELAY25  (via drill 0.3)
  Top 0.152: U0701.17 53.13,57.58 v53.34,57.78
  Bottom 0.152: X1602.5 60.96,66.04 60.96,68.26 60.64,68.58 53.66,68.58 53.34,68.26 v53.34,57.78
RELAY26  (via drill 0.3)
  Top 0.152: U0701.18 52.48,58.2 v52.7,58.42
  Bottom 0.152: X1602.6 62.23,68.9 61.91,69.22 53.02,69.22 52.7,68.9 v52.7,58.42
RELAY27  (via drill 0.3)
  Top 0.152: U0701.20 51.19,57.85 v51.75,58.42
  Bottom 0.152: X1602.7 63.5,66.04 63.5,69.53 63.18,69.85 52.07,69.85 51.75,69.53 v51.75,58.42
RELAY28  (via drill 0.3)
  Top 0.152: U0701.21 50.53,58.47 v51.12,59.05
  Bottom 0.152: X1602.8 64.77,70.17 64.45,70.48 51.44,70.48 51.12,70.17 v51.12,59.05
RELAY29
  Top 0.152: X1602.9 66.04,66.04 66.04,68.26 65.72,68.58 46.35,68.58 45.98,68.21 U0701.28
RELAY30
  Top 0.152: X1602.10 67.31,68.9 66.99,69.22 45.72,69.22 45.34,68.83 U0701.29
RELAY31
  Top 0.152: X1602.11 68.58,66.04 68.58,69.53 68.26,69.85 44.45,69.85 44.03,69.44 U0701.31
RELAY32
  Top 0.152: X1602.12 69.85,70.17 69.53,70.48 43.81,70.48 43.38,70.06 U0701.32
RELAY33  (via drill 0.3)
  Top 0.152: U0801.1 57.99,47.42 v57.78,47.62
  Bottom 0.152: v57.78,47.62 56.52,47.62 56.2,47.94 56.2,50.8 59.69,54.29 72.07,54.29 72.39,54.61 X1602.13
RELAY34  (via drill 0.3)
  Top 0.152: U0801.2 60.55,48.36 60.33,48.58 v58.42,48.58
  Bottom 0.152: v58.42,48.58 57.15,48.58 56.83,48.9 56.83,50.48 60.01,53.66 73.34,53.66 73.66,53.98 73.66,66.04 X1602.14
RELAY35  (via drill 0.3)
  Top 0.152: U0801.4 61.84,48.01 60.64,49.21 v57.78,49.21
  Bottom 0.152: v57.78,49.21 57.47,49.53 57.47,50.16 60.33,53.02 74.61,53.02 74.93,53.34 X1602.15
RELAY36  (via drill 0.3)
  Top 0.152: U0801.5 62.49,48.63 62.23,48.9 61.59,48.9 60.64,49.85 v58.42,49.85
  Bottom 0.152: v58.42,49.85 60.96,52.39 75.88,52.39 76.2,52.7 76.2,66.04 X1602.16
RM_FWD
  Bottom 0.305: X1501.1 L0901.2
RM_REV
  Bottom 0.152: L0911.2 X1511.1
RS_DTE_CTS
  Top 0.152: U1001.7 81.6,41.27 81.92,40.96 81.92,38.73 82.55,38.1 X1053.1
  Bottom 0.152: C1053.1 91.86,38.95 X1053.1
RS_DTE_RTR
  Top 0.152: U1001.8 80.01,39.95 80.01,38.1 85.09,33.02 X1053.2
  Bottom 0.152: C0054.1 91.86,33.87 X1053.2
RS_DTE_RXD  (via drill 0.3)
  Top 0.152: v88.27,46.35 U1001.14
  Bottom 0.152: v88.27,46.35 88.9,46.99 88.9,60.33 89.53,60.96 X1051.1 91.86,61.81 C1051.1
RS_DTE_TXD  (via drill 0.3)
  Top 0.152: v88.9,45.09 U1001.13
  Bottom 0.152: v88.9,45.09 90.17,46.35 90.17,55.24 90.81,55.88 X1051.2 91.86,56.73 C1052.1
RS_MX_C1N1
  Top 0.152: U1001.3 78.74,46.35 77.47,47.62 76.84,47.62 C1002.2
RS_MX_C1P
  Top 0.152: U1001.1 78.42,48.9 77.79,49.53 76.84,49.53 C1002.1
RS_MX_C2M1
  Top 0.152: U1001.5 78.11,43.81 77.79,43.5 76.84,43.5 C1003.2
RS_MX_C2P
  Top 0.152: U1001.4 78.11,45.09 77.79,45.4 76.84,45.4 C1003.1
RS_MX_VM
  Top 0.152: U1001.6 78.74,42.55 77.47,41.27 77.15,41.27 C1005.1
RS_MX_VP
  Top 0.152: U1001.2 81.28,47.62 81.6,47.94 81.6,49.53 81.28,49.85 80.01,49.85 79.69,50.16 79.69,51.12 C1004.1
SPI_DRV_!RST  (via drill 0.3)
  Top 0.152: U0701.27 46.63,61.88 v46.67,61.91 v54.61,61.91 | U0801.27 63.15,61.88 v63.18,61.91 72.71,61.91 73.03,61.59 v73.03,42.86 | U0601.27 30.12,59.65 v32.38,61.91 | v61.28,36.2 v51.75,36.2
  Bottom 0.152: v46.67,61.91 v32.38,61.91 | v54.61,61.91 v63.18,61.91 | v73.03,42.86 73.03,39.37 69.85,36.2 v61.28,36.2 | R0625.2 68.9,8.26 67.63,6.99 65.09,6.99 63.82,8.26 56.83,8.26 52.07,13.02 52.07,35.88 v51.75,36.2
SPI_DRV_C_!CS  (via drill 0.3)
  Top 0.152: v50.16,39.69 50.48,40.01 v62.23,40.01 | v60.33,41.59 53.98,41.59 51.84,43.73 U0701.14
  Bottom 0.152: R0724.2 70.48,7.62 68.58,5.71 64.45,5.71 63.18,6.99 56.2,6.99 50.8,12.38 50.8,35.24 50.16,35.88 v50.16,39.69 | v62.23,40.01 62.23,41.27 61.91,41.59 v60.33,41.59
SPI_DRV_EXT_!CS  (via drill 0.3)
  Top 0.152: R0824.2 v71.12,8.26 | U0801.14 68.34,45.95 70.17,44.13 v70.17,42.86 | v60.33,38.1 v49.21,38.1
  Bottom 0.152: v71.12,8.26 71.12,6.99 69.22,5.08 64.14,5.08 62.87,6.35 55.88,6.35 50.16,12.06 50.16,34.92 49.21,35.88 v49.21,38.1 | v70.17,42.86 70.17,39.37 68.9,38.1 v60.33,38.1
SPI_DRV_L_!CS  (via drill 0.3)
  Top 0.152: U0601.14 35.33,45.95 35.88,45.4 v35.88,43.81 | R0624.2 v69.53,8.26 | v61.28,38.73 v50.8,38.73
  Bottom 0.152: v35.88,43.81 44.13,43.81 45.09,44.77 51.44,44.77 52.39,43.81 60.64,43.81 61.59,44.77 66.67,44.77 69.53,42.23 69.53,39.69 68.58,38.73 v61.28,38.73 | v69.53,8.26 69.53,7.94 67.94,6.35 64.77,6.35 63.5,7.62 56.52,7.62 51.44,12.7 51.44,35.56 50.8,36.2 v50.8,38.73
SPI_DRV_PWM  (via drill 0.3)
  Top 0.152: v44.77,61.28 44.69,61.2 U0701.30 44.69,55.8 v42.86,53.98 | U0801.30 61.2,61.2 v61.28,61.28 | v47.94,61.28 v55.56,61.28 | U0601.30 28.18,55.33 v28.26,55.24 | v69.85,61.28 72.07,61.28 72.39,60.96 72.39,45.4 v72.07,45.09 | R0626.2 v83.5,12.38 | v77.47,38.1 v80.96,34.61 | v88.9,29.21 v83.5,23.81
  Bottom 0.152: v44.77,61.28 v47.94,61.28 | v55.56,61.28 v61.28,61.28 v69.85,61.28 | v42.86,53.98 38.1,49.21 35.56,49.21 29.53,55.24 v28.26,55.24 | v72.07,45.09 73.66,43.5 73.66,39.37 73.98,39.05 77.15,39.05 77.47,38.73 v77.47,38.1 | v83.5,12.38 v83.5,23.81 | v80.96,34.61 83.5,32.07 86.04,32.07 v88.9,29.21
SPI_DRV_SCLK  (via drill 0.3)
  Top 0.152: U0601.11 33.38,46.63 34.61,45.4 v34.61,43.18 | U0701.11 49.88,46.63 51.12,45.4 v51.12,43.18 | U0801.11 66.39,46.63 68.9,44.13 v68.9,41.91 | R0621.2 v66.36,8.89 | v54.61,39.37 v60.33,39.37
  Bottom 0.152: v34.61,43.18 44.45,43.18 45.4,44.13 50.16,44.13 v51.12,43.18 60.96,43.18 61.91,44.13 66.36,44.13 v68.9,41.91 68.9,40.01 68.26,39.37 v60.33,39.37 | v66.36,8.89 65.09,10.16 57.78,10.16 53.98,13.97 53.98,34.61 54.61,35.24 v54.61,39.37
SPI_DRV_SI  (via drill 0.3)
  Top 0.152: U0701.19 51.84,55.48 v52.39,54.93 | U0801.19 68.34,55.8 v68.9,55.24 70.8,53.34 v70.8,41.91 | U0601.19 35.33,55.48 v35.88,54.93 | R0623.2 v67.94,8.26 | v61.28,37.47 v52.7,37.47
  Bottom 0.152: v68.9,55.24 68.58,54.93 v52.39,54.93 v35.88,54.93 | v70.8,41.91 70.8,39.05 69.22,37.47 v61.28,37.47 | v67.94,8.26 67.31,7.62 65.41,7.62 64.14,8.89 57.15,8.89 52.7,13.34 v52.7,37.47
SPI_DRV_SO  (via drill 0.3)
  Top 0.152: v54.29,60.33 54.19,60.22 R0711.1 48.16,60.22 v47.94,60.33 | v65.09,60.33 65.94,59.91 R0811.1 71.22,60.02 71.44,59.69 v71.44,42.86 | R0611.1 35.46,60.22 v35.56,60.33 | v60.33,36.83 v53.66,36.83
  Bottom 0.152: v54.29,60.33 v65.09,60.33 | v35.56,60.33 v47.94,60.33 | v71.44,42.86 71.44,38.73 69.53,36.83 v60.33,36.83 | R0622.2 67.31,8.57 66.99,8.26 65.72,8.26 64.45,9.53 57.47,9.53 53.34,13.65 53.34,36.51 v53.66,36.83
SWR_IN_FWD  (via drill 0.3)
  Top 0.152: R0903.1 6.97,26.05 v7.3,25.72
  Bottom 0.152: R0902.2 7.62,25.4 v7.3,25.72 4.8,28.22 U0921.1
SWR_IN_FWD_HI
  Bottom 0.305: C0901.1 5.93,22.64 6.35,22.23 L0901.1 | C0901.1 R0901.2 | C0901.1 7.2,22.86 R0902.1
SWR_IN_REV  (via drill 0.3)
  Top 0.152: R0913.1 8.24,30.81 v7.3,31.75
  Bottom 0.152: R0912.2 7.62,32.07 v7.3,31.75 7.9,31.15 U0921.5
SWR_IN_REV_HI
  Bottom 0.152: C0911.1 5.73,34.62 6.35,35.24 L0911.1 | R0912.1 6.97,33.67 6.35,34.29 C0911.1 | R0911.2 C0911.1
SWR_OP1_OUT  (via drill 0.3)
  Top 0.152: D0951.C 12.7,25.08 13.02,24.77 v14.61,24.77
  Bottom 0.152: v14.61,24.77 14.58,24.74 U0951.1 13.64,22.7 R0961.1
SWR_OP2_IN  (via drill 0.3)
  Top 0.152: v11.75,18.73 v11.76,18.72 U0961.4 11.75,17.74 R0962.1 11.45,16.05 10.79,15.4 v10.79,11.59
  Bottom 0.152: C0963.1 11.76,19.53 R0961.2 v11.75,18.73 | U0962.6 17.73,11.38 15.88,9.53 10.95,9.53 10.79,9.68 v10.79,11.59
SWR_OP2_OUT  (via drill 0.3)
  Top 0.152: U0961.1 14.26,20.34 v14.29,20.32
  Bottom 0.152: R0963.2 15.4,18.75 C0963.2 | R0972.1 15.4,20.3 C0963.2 | v14.29,20.32 14.62,19.99 C0963.2
SWR_SEL_FWD  (via drill 0.3)
  Top 0.152: R0921.2 59.05,18.59 58.74,18.73 50.16,18.73 v48.58,20.32 | v9.21,28.57 12.06,28.57 12.38,28.89 18.73,28.89 v19.05,28.57
  Bottom 0.152: v48.58,20.32 47.62,21.27 43.18,21.27 41.27,23.18 34.92,23.18 29.53,28.57 v19.05,28.57 | U0921.7 8.82,28.96 v9.21,28.57
SWR_SEL_PWR  (via drill 0.3)
  Top 0.152: D0951.A v12.7,27.94
  Bottom 0.152: v12.7,27.94 12.09,27.33 U0951.4 11.76,28.25 11.43,28.57 11.43,29.2 11.16,29.46 U0921.6 6.6,29.46 6.1,28.96 U0921.2
SWR_SEL_REV  (via drill 0.3)
  Top 0.152: R0922.2 60.31,12.08 59.37,13.02 v49.45,13.02 | v6.03,30.16 6.67,29.53 v20,29.53
  Bottom 0.152: v49.45,13.02 49.45,20.4 47.62,22.23 43.81,22.23 42.23,23.81 35.56,23.81 29.84,29.53 v20,29.53 | U0921.3 5.08,29.53 5.4,29.53 v6.03,30.16
TPS_LBI  (via drill 0.3)
  Top 0.152: U1301.6 14.24,36.47 13.97,36.2 v13.32,36.2
  Bottom 0.152: R1302.1 v13.32,36.2 | 13.12,36.62 13.12,36.41
  Bottom 0.305: 13.12,36.62 R1301.2 | 13.12,36.41 v13.32,36.2
TPS_LBO  (via drill 0.3)
  Top 0.152: 15.74,42.41 17.14,43.81 23.5,43.81 24.77,42.55 v24.77,41.27
  Top 0.305: U1301.2 15.74,42.41
  Bottom 0.305: R1322.1 24.55,41.06 v24.77,41.27
TPS_PG  (via drill 0.3)
  Top 0.152: U1301.4 14.74,40.77 v13.65,39.69
  Bottom 0.152: R1321.1 24.55,39.27 v24.13,39.37 18.73,39.37 17.78,40.64 14.61,40.64 v13.65,39.69
TPS_SW
  Top 0.254: U1301.9 15.74,38.6 15.88,38.73
  Top 0.305: 15.88,38.73 17.24,38.73 18.73,36.83 L1311.4 L1311.2
USB_SHIELD
  Bottom 0.305: X1401.JSHIELD 93.36,19.09 X1401.JSHIELD@3 X1401.JSHIELD@4 X1401.JSHIELD@5 X1401.JSHIELD@6 93.36,24.11 X1401.JSHIELD@2 91.63,24.11 C1403.2 R1402.2
VDDUSB  (via drill 0.3)
  Top 0.152: U0101.48 81.6,22.8 | 84.88,22.8 v85.09,22.54 | v85.09,18.73 85.09,18.92 PF1411.2
  Top 0.305: 84.88,22.8 81.6,22.8 81.6,25.4 83.71,27.51 D1221.A
  Bottom 0.305: v85.09,22.54 v85.09,18.73

## Text on the board
tPlace: 2 | 22 | 36 | 12V | 12V | DL0WH BiTuner Ctrl V1.2 / (C) 2019 | 23 | - | 1 | 21 | 22 | 35 | 12V | 12V | BAT | OUTPUT A | OUTPUT B | RXD | RS232 | TXD | 12V | + | GND | FWD | GND | CTS | BOOT0 | I2C | RTR | SCL | SDA | USB | REV | CAT Ifc. | SWD | RTR | CTS | GND | GND | TXD | RXD | RESET
Measures: 4x